# EAGLE schematic motor-driver (EAGLE 9.6.2)
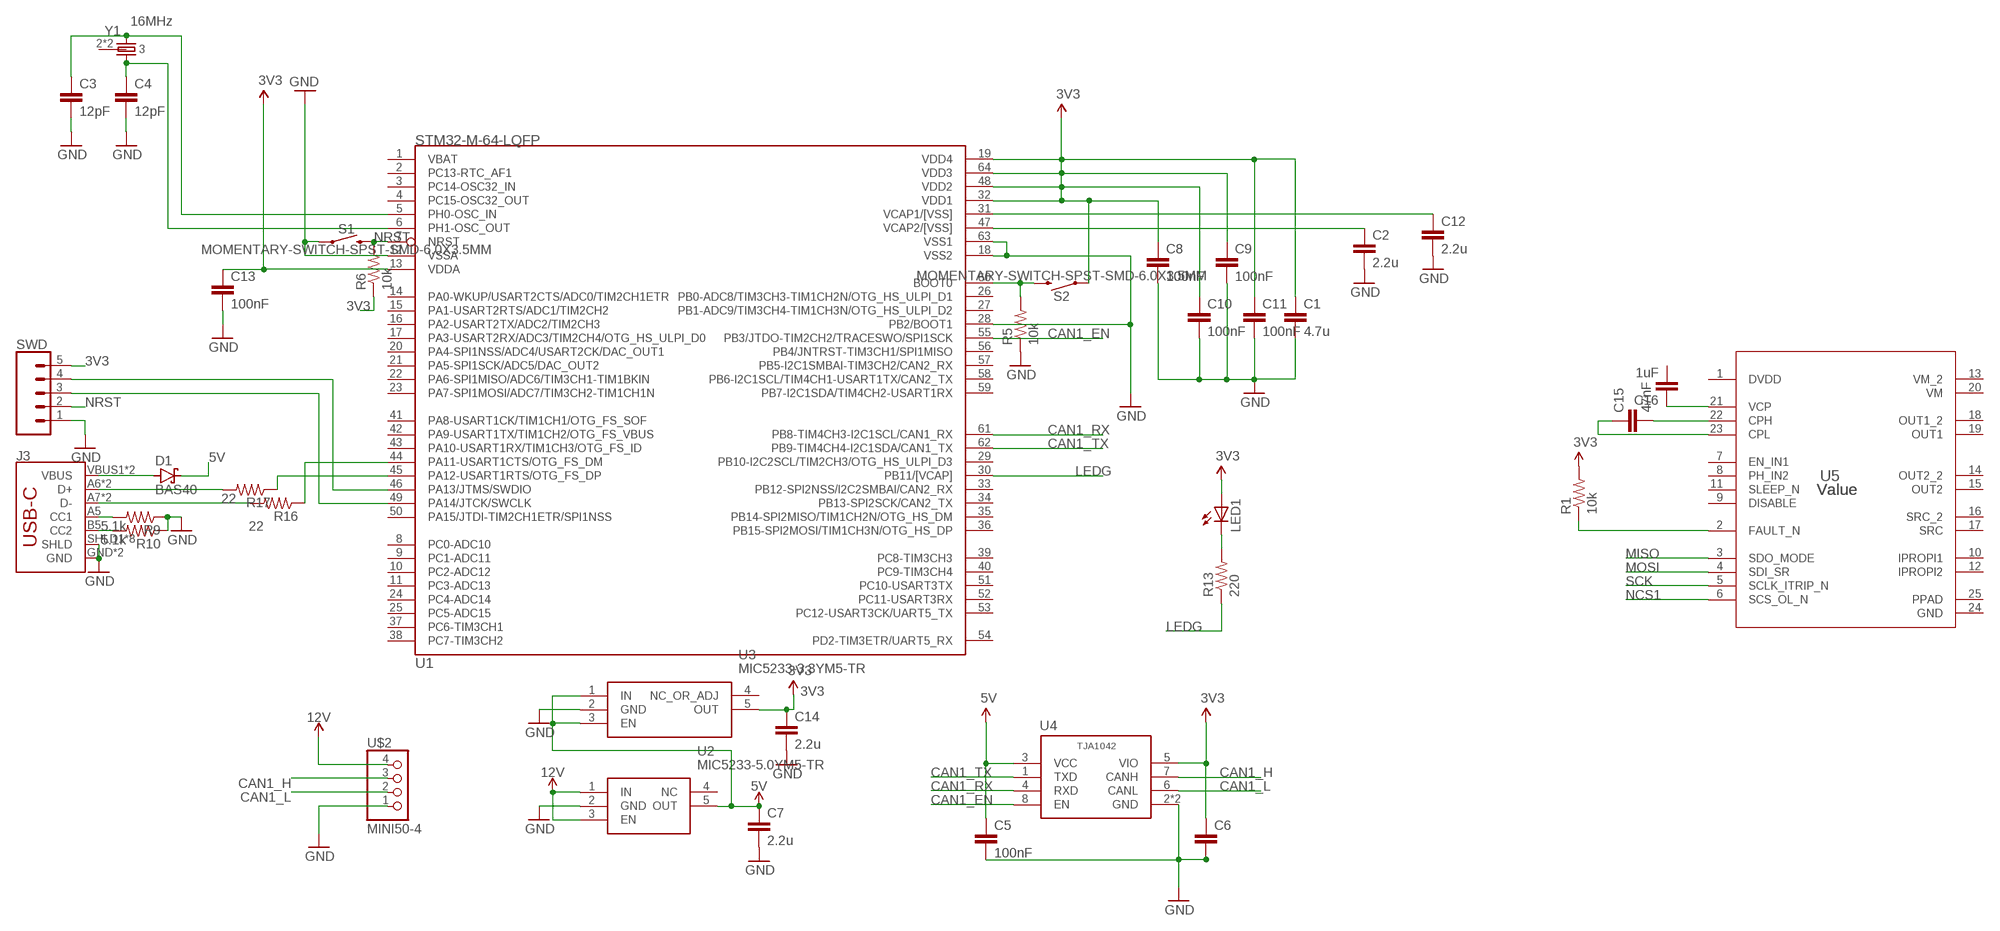
[diagram p0: schematic, sheet 1]

## Parts
C1  4.7u  C0603  [0603-C]
C2  2.2u  C0603  [0603-C]
C3  12pF  C0603  [0603-C]
C4  12pF  C0603  [0603-C]
C5  100nF  C0603  [0603-C]
C6  100nF  C0603  [0603-C]
C7  2.2u  C-EUC0603  [C0603]
C8  100nF  C0603  [0603-C]
C9  100nF  C0603  [0603-C]
C10  100nF  C0603  [0603-C]
C11  100nF  C0603  [0603-C]
C12  2.2u  C0603  [0603-C]
C13  100nF  C0603  [0603-C]
C14  2.2u  C-EUC0603  [C0603]
C15  47nF  C0603  [0603-C]
C16  1uF  C0603  [0603-C]
D1  BAS40  [SOT23]
J3  USB-C-BREAKOUT_SPARKFUN-CONNECTORS_USB_C16PIN  [USB-C-BREAKOUT_SPARKFUN-CONNECTORS_USB-C-16P]
LED1  LEDCHIPLED_0805  [CHIPLED_0805]
R1  10k  R0402  [0402-R]
R5  10k  R0402  [0402-R]
R6  10k  R0402  [0402-R]
R9  5.1k  R0402  [0402-R]
R10  5.1k  R0402  [0402-R]
R13  220  R0402  [0402-R]
R16  22  R0402  [0402-R]
R17  22  R0402  [0402-R]
S1  MOMENTARY-SWITCH-SPST-SMD-6.0X3.5MM  [TACTILE_SWITCH_SMD_6.0X3.5MM]
S2  MOMENTARY-SWITCH-SPST-SMD-6.0X3.5MM  [TACTILE_SWITCH_SMD_6.0X3.5MM]
SWD  CONN_051.27MM  [1X05_1.27MM]
U1  STM32-M-64-LQFP  [LQFP64]
U2  MIC5233-5.0YM5-TR  [SOT95P280X145-5N]
U3  MIC5233-3.3YM5-TR  [SOT95P280X145-5N]
U4  TJA1042HVSON  [HVSON8]
U5  Value  DRV8873HPWPRQ1  [PWP0024J_N]
U$2  MINI50-4  [MINI50]
Y1  16MHz  CRYSTAL-3.2X2.54-PIN  [XTAL-3.2X2.5]

## Nets
3V3: C1.1 C6.1 C8.1 C9.1 C10.1 C11.1 C13.1 C14.1 LED1.A R6.1 S2.1 SWD.5 U1.13(VDDA) U1.19(VDD4) U1.32(VDD1) U1.48(VDD2) U1.64(VDD3) U3.5(OUT) U4.5(VIO)
5V: C5.1 C7.1 D1.3(C) U2.5(OUT) U3.1(IN) U3.3(EN) U4.3(VCC)
12V: U2.1(IN) U2.3(EN) U$2.4
CAN1_EN: U1.55(PB3/JTDO-TIM2CH2/TRACESWO/SPI1SCK) U4.8(EN)
CAN1_H: U4.7(CANH) U$2.3
CAN1_L: U4.6(CANL) U$2.2
CAN1_RX: U1.61(PB8-TIM4CH3-I2C1SCL/CAN1_RX) U4.4(RXD)
CAN1_TX: U1.62(PB9-TIM4CH4-I2C1SDA/CAN1_TX) U4.1(TXD)
GND: C1.2 C2.2 C3.2 C4.2 C5.2 C6.2 C7.2 C8.2 C9.2 C10.2 C11.2 C12.2 C13.2 C14.2 J3.GND J3.GND2(GND) J3.SHLD1(SHLD) J3.SHLD2(SHLD) J3.SHLD3(SHLD) J3.SHLD4(SHLD) J3.SHLD5(SHLD) J3.SHLD6(SHLD) J3.SHLD7(SHLD) J3.SHLD8(SHLD) R5.1 R9.1 R10.1 S1.1 SWD.1 U1.12(VSSA) U1.18(VSS2) U1.28(PB2/BOOT1) U1.63(VSS1) U2.2(GND) U3.2(GND) U4.2(GND) U4.PAD(GND) U$2.1
LEDG: R13.1 U1.30(PB11/[VCAP])
MISO: U5.3(SDO_MODE)
MOSI: U5.4(SDI_SR)
N$1: C3.1 U1.5(PH0-OSC_IN) Y1.1
N$2: R16.1 U1.44(PA11-USART1CTS/OTG_FS_DM)
N$3: C4.1 U1.6(PH1-OSC_OUT) Y1.3
N$4: R17.1 U1.45(PA12-USART1RTS/OTG_FS_DP)
N$5: J3.A7(D-) J3.B7(D-) R16.2
N$6: J3.A6(D+) J3.B6(D+) R17.2
N$7: R5.2 S2.2 U1.60(BOOT0)
N$8: J3.A5(CC1) R9.2
N$9: J3.B5(CC2) R10.2
N$10: C15.2 U5.22(CPH)
N$11: D1.1(A) J3.VBUS1(VBUS) J3.VBUS2(VBUS)
N$12: SWD.3 U1.49(PA14/JTCK/SWCLK)
N$13: SWD.4 U1.46(PA13/JTMS/SWDIO)
N$14: C15.1 U5.23(CPL)
N$15: C16.1 U5.21(VCP)
N$16: R1.1 U5.2(FAULT_N)
N$26: LED1.C R13.2
NCS1: U5.6(SCS_OL_N)
NRST: R6.2 S1.2 SWD.2 U1.7(NRST)
SCK: U5.5(SCLK_ITRIP_N)
VCAP1: C12.1 U1.31(VCAP1/[VSS])
VCAP2: C2.1 U1.47(VCAP2/[VSS])
VCC: R1.2 ; supply symbol labelled 3V3
Unconnected: C16.2 U1.1(VBAT) U1.2(PC13-RTC_AF1) U1.3(PC14-OSC32_IN) U1.4(PC15-OSC32_OUT) U1.8(PC0-ADC10) U1.9(PC1-ADC11) U1.10(PC2-ADC12) U1.11(PC3-ADC13) U1.14(PA0-WKUP/USART2CTS/ADC0/TIM2CH1ETR) U1.15(PA1-USART2RTS/ADC1/TIM2CH2) U1.16(PA2-USART2TX/ADC2/TIM2CH3) U1.17(PA3-USART2RX/ADC3/TIM2CH4/OTG_HS_ULPI_D0) U1.20(PA4-SPI1NSS/ADC4/USART2CK/DAC_OUT1) U1.21(PA5-SPI1SCK/ADC5/DAC_OUT2) U1.22(PA6-SPI1MISO/ADC6/TIM3CH1-TIM1BKIN) U1.23(PA7-SPI1MOSI/ADC7/TIM3CH2-TIM1CH1N) U1.24(PC4-ADC14) U1.25(PC5-ADC15) U1.26(PB0-ADC8/TIM3CH3-TIM1CH2N/OTG_HS_ULPI_D1) U1.27(PB1-ADC9/TIM3CH4-TIM1CH3N/OTG_HS_ULPI_D2) U1.29(PB10-I2C2SCL/TIM2CH3/OTG_HS_ULPI_D3) U1.33(PB12-SPI2NSS/I2C2SMBAI/CAN2_RX) U1.34(PB13-SPI2SCK/CAN2_TX) U1.35(PB14-SPI2MISO/TIM1CH2N/OTG_HS_DM) U1.36(PB15-SPI2MOSI/TIM1CH3N/OTG_HS_DP) U1.37(PC6-TIM3CH1) U1.38(PC7-TIM3CH2) U1.39(PC8-TIM3CH3) U1.40(PC9-TIM3CH4) U1.41(PA8-USART1CK/TIM1CH1/OTG_FS_SOF) U1.42(PA9-USART1TX/TIM1CH2/OTG_FS_VBUS) U1.43(PA10-USART1RX/TIM1CH3/OTG_FS_ID) U1.50(PA15/JTDI-TIM2CH1ETR/SPI1NSS) U1.51(PC10-USART3TX) U1.52(PC11-USART3RX) U1.53(PC12-USART3CK/UART5_TX) U1.54(PD2-TIM3ETR/UART5_RX) U1.56(PB4/JNTRST-TIM3CH1/SPI1MISO) U1.57(PB5-I2C1SMBAI-TIM3CH2/CAN2_RX) U1.58(PB6-I2C1SCL/TIM4CH1-USART1TX/CAN2_TX) U1.59(PB7-I2C1SDA/TIM4CH2-USART1RX) U2.4(NC) U3.4(NC_OR_ADJ) U5.7(EN_IN1) U5.8(PH_IN2) U5.9(DISABLE) U5.10(IPROPI1) U5.11(SLEEP_N) U5.12(IPROPI2) U5.14(OUT2_2) U5.15(OUT2) U5.16(SRC_2) U5.17(SRC) U5.18(OUT1_2) U5.19(OUT1) Y1.2 Y1.4

## Power pins joined to a net without a drawn wire
DVDD: U5.1(DVDD)
GND: U5.24(GND)
PPAD: U5.25(PPAD)
VM: U5.20(VM)
VM_2: U5.13(VM_2)

## Library data of the parts
C1-C6 C8-C13 C15 C16 = comma.ai:C
C7 C14 = rcl:C-EU: CAPACITOR, European symbol; SPICEPREFIX: C
D1 = diode:BAS40: Silicon Schottky Diodes General-purpose diode for high-speed switching
J3 = ROTR-Wireless:USB-C-BREAKOUT_SPARKFUN-CONNECTORS_USB_C: USB Type C 16Pin Connector Super Speed pins not available on the 16-pin purely SMD connector so this part is best for USB 2.0 implementations. D1 and D2 are tied together enabling D+/- no matter which way the cable is plugged into the connector. The two channel configuration pins (CC1/2) are exposed. These are normally connected to ground via 5.1k resistors but can be reconfigured for high current/high power applications.; PROD_ID: CONN-14122
LED1 = adafruit:LED: LED OSRAM: - CHIPLED LG R971, LG N971, LY N971, LG Q971, LY Q971, LO R971, LY R971 LH N974, LH R974 LS Q976, LO Q976, LY Q976 LO Q996 - Hyper CHIPLED LW Q18S LB Q993, LB Q99A, LB R99A - SideLED LS A670, LO A670, LY A670, LG A670, LP A670 LB A673, LV A673, LT A673, LW A673 LH A674 LY A675 LS A676, LA A676, LO A676, LY A676, LW A676 LS A679, LY A679, LG A679 - Hyper Micro SIDELED® LS Y876, LA Y876, LO Y876, LY Y876 LT Y87S - SmartLED LW L88C, LW L88S LB L89C, LB L89S, LG L890 LS L89K, LO L89K, LY L89K LS L896, LA L896, LO L896, LY L896 - TOPLED LS T670, LO T670, LY T670, LG T670, LP T670 LSG T670, LSP T670, LSY T670, LOP T670, LYG T670 LG T671, LOG T671, LSG T671 LB T673, LV T673, LT T673, LW T673 LH T674 LS T676, LA T676, LO T676, LY T676, LB T676, LH T676, LSB T676, LW T676 LB T67C, LV T67C, LT T67C, LS T67K, LO T67K, LY T67K, LW E67C LS E67B, LA E67B, LO E67B, LY E67B, LB E67C, LV E67C, LT E67C LW T67C LS T679, LY T679, LG T679 LS T770, LO T770, LY T770, LG T770, LP T770 LB T773, LV T773, LT T773, LW T773 LH T774 LS E675, LA E675, LY E675, LS T675 LS T776, LA T776, LO T776, LY T776, LB T776 LHGB T686 LT T68C, LB T68C - Hyper Mini TOPLED® LB M676 - Mini TOPLED Santana® LG M470 LS M47K, LO M47K, LY M47K Source: http://www.osram.convergy.de/
R1 R5 R6 R9 R10 R13 R16 R17 = comma.ai:R
S1 S2 = SparkFun-Switches:MOMENTARY-SWITCH-SPST: Momentary Switch (Pushbutton) - SPST Normally-open (NO) SPST momentary switches (buttons, pushbuttons). Variants PTH-12MM - 12mm square, through-hole Momentary Pushbutton Switch - 12mm Square <https://www.sparkfun.com/products/9190> (COM-09190) PTH-6.0MM, PTH-6.0MM-KIT - 6.0mm square, through-hole Mini Pushbutton Switch <https://www.sparkfun.com/products/97> (COM-00097) KIT package intended for soldering kit's - only one side of pads' copper is exposed. PTH-RIGHT-ANGLE-KIT - Right-angle, through-hole Right Angle Tactile Button <https://www.sparkfun.com/products/10791> - Used on SparkFun BigTime Watch Kit <https://www.sparkfun.com/products/11734> SMD-12MM - 12mm square, surface-mount Tactile Button - SMD (12mm) <https://www.sparkfun.com/products/12993> (COM-12993) Used on SparkFun PicoBoard <https://www.sparkfun.com/products/11888> SMD-4.5MM - 4.5mm Square Trackball Switch Used on SparkFun Blackberry Trackballer Breakout <https://www.sparkfun.com/products/13169> SMD-4.6MMX2.8MM - 4.60mm x 2.80mm, surface mount Used on SparkFun SAMD21 Mini Breakout <https://www.sparkfun.com/products/13664> SMD-5.2MM, SMD-5.2-REDUNDANT - 5.2mm square, surface-mount Mini Pushbutton Switch - SMD <https://www.sparkfun.com/products/8720> (COM-08720) Used on Arduino Pro Mini <https://www.sparkfun.com/products/11114> REDUNDANT package connects both switch circuits together SMD-6.0X3.5MM - 6.0 x 3.5mm, surface mount Momentary Reset Switch SMD <https://www.sparkfun.com/products/8229> (COM-08229) SMD-6.2MM-TALL - 6.2mm square, surface mount Tactile Button - SMD (6mm) <https://www.sparkfun.com/products/12992> Used on SparkFun Digital Sandbox <https://www.sparkfun.com/products/12651> SMD-RIGHT-ANGLE - Right-angle, surface mount Used on SparkFun Block for Intel® Edison - Arduino <https://www.sparkfun.com/products/13036>; PROD_ID: SWCH-00815; SF_SKU: COM-08229
SWD = SparkFun-Connectors:CONN_05: Multi connection point. Often used as Generic Header-pin footprint for 0.1 inch spaced/style header connections On any of the 0.1 inch spaced packages, you can populate with these: Break Away Headers - Straight <https://www.sparkfun.com/products/116> (PRT-00116) Break Away Male Headers - Right Angle <https://www.sparkfun.com/products/553> (PRT-00553) Female Headers <https://www.sparkfun.com/products/115> (PRT-00115) Break Away Headers - Machine Pin <https://www.sparkfun.com/products/117> (PRT-00117) Break Away Female Headers - Swiss Machine Pin <https://www.sparkfun.com/products/743> (PRT-00743) For SCREWTERMINALS and SPRING TERMINALS visit here: Screw Terimnals on SparkFun.com <https://www.sparkfun.com/search/results?term=Screw+Terminals> (5mm/3.5mm/2.54mm spacing) This device is also useful as a general connection point to wire up your design to another part of your project. Our various solder wires solder well into these plated through hole pads. Hook-Up Wire - Assortment (Stranded, 22 AWG) <https://www.sparkfun.com/products/11375> (PRT-11375) Hook-Up Wire - Assortment (Solid Core, 22 AWG) <https://www.sparkfun.com/products/11367> (PRT-11367) View the entire wire category on our website here <https://www.sparkfun.com/categories/141> Special notes: Molex polarized connector foot print use with SKU : PRT-08231 with associated crimp pins and housings. 1MM SMD Version SKU: PRT-10208
U1 = comma.ai:STM32-M-64-LQFP: STM32F103 Medium Density 64pin LQFP
U2 = SamacSys_Parts:MIC5233-5.0YM5-TR: MICROCHIP - MIC5233-5.0YM5-TR - LDO, REG, 36VIN, 0.1A, 5V, 2%, 5SOT23 Source: Datasheet <https://componentsearchengine.com/Datasheets/2/MIC5233-5.0YM5-TR.pdf>; DESCRIPTION: MICROCHIP - MIC5233-5.0YM5-TR - LDO, REG, 36VIN, 0.1A, 5V, 2%, 5SOT23; HEIGHT: 1.45mm; MANUFACTURER_NAME: Microchip; MANUFACTURER_PART_NUMBER: MIC5233-5.0YM5-TR; MOUSER_PART_NUMBER: 998-MIC5233-5.0YM5TR; MOUSER_PRICE-STOCK: https://www.mouser.co.uk/ProductDetail/Microchip-Technology-Micrel/MIC5233-50YM5-TR?qs=U6T8BxXiZAWSnpCHgrMajw%3D%3D
U3 = SamacSys_Parts:MIC5233-3.3YM5-TR: High Input Voltage Low IQ UCAP LDO Regulator Source: Datasheet <http://ww1.microchip.com/downloads/en/DeviceDoc/MIC5233-Data-Sheet-DS20006033D.pdf>; DESCRIPTION: High Input Voltage Low IQ UCAP LDO Regulator; HEIGHT: 1.45mm; MANUFACTURER_NAME: Microchip; MANUFACTURER_PART_NUMBER: MIC5233-3.3YM5-TR; MOUSER_PART_NUMBER: 998-MIC5233-3.3YM5TR; MOUSER_PRICE-STOCK: https://www.mouser.co.uk/ProductDetail/Microchip-Technology-Micrel/MIC5233-33YM5-TR?qs=U6T8BxXiZAWDhshLMgpaLQ%3D%3D
U4 = comma.ai:TJA1042
U5 = comma.ai:DRV8873HPWPRQ1; MANUFACTURER: Texas Instruments; PARTNUMBER: DRV8873SPWPRQ1; REFDES: RefDes; TYPE: TYPE
U$2 = interceptor:MINI50-4
Y1 = comma.ai:CRYSTAL-3.2X2.5